# Altium schematic sheet left.SchDoc
size A1
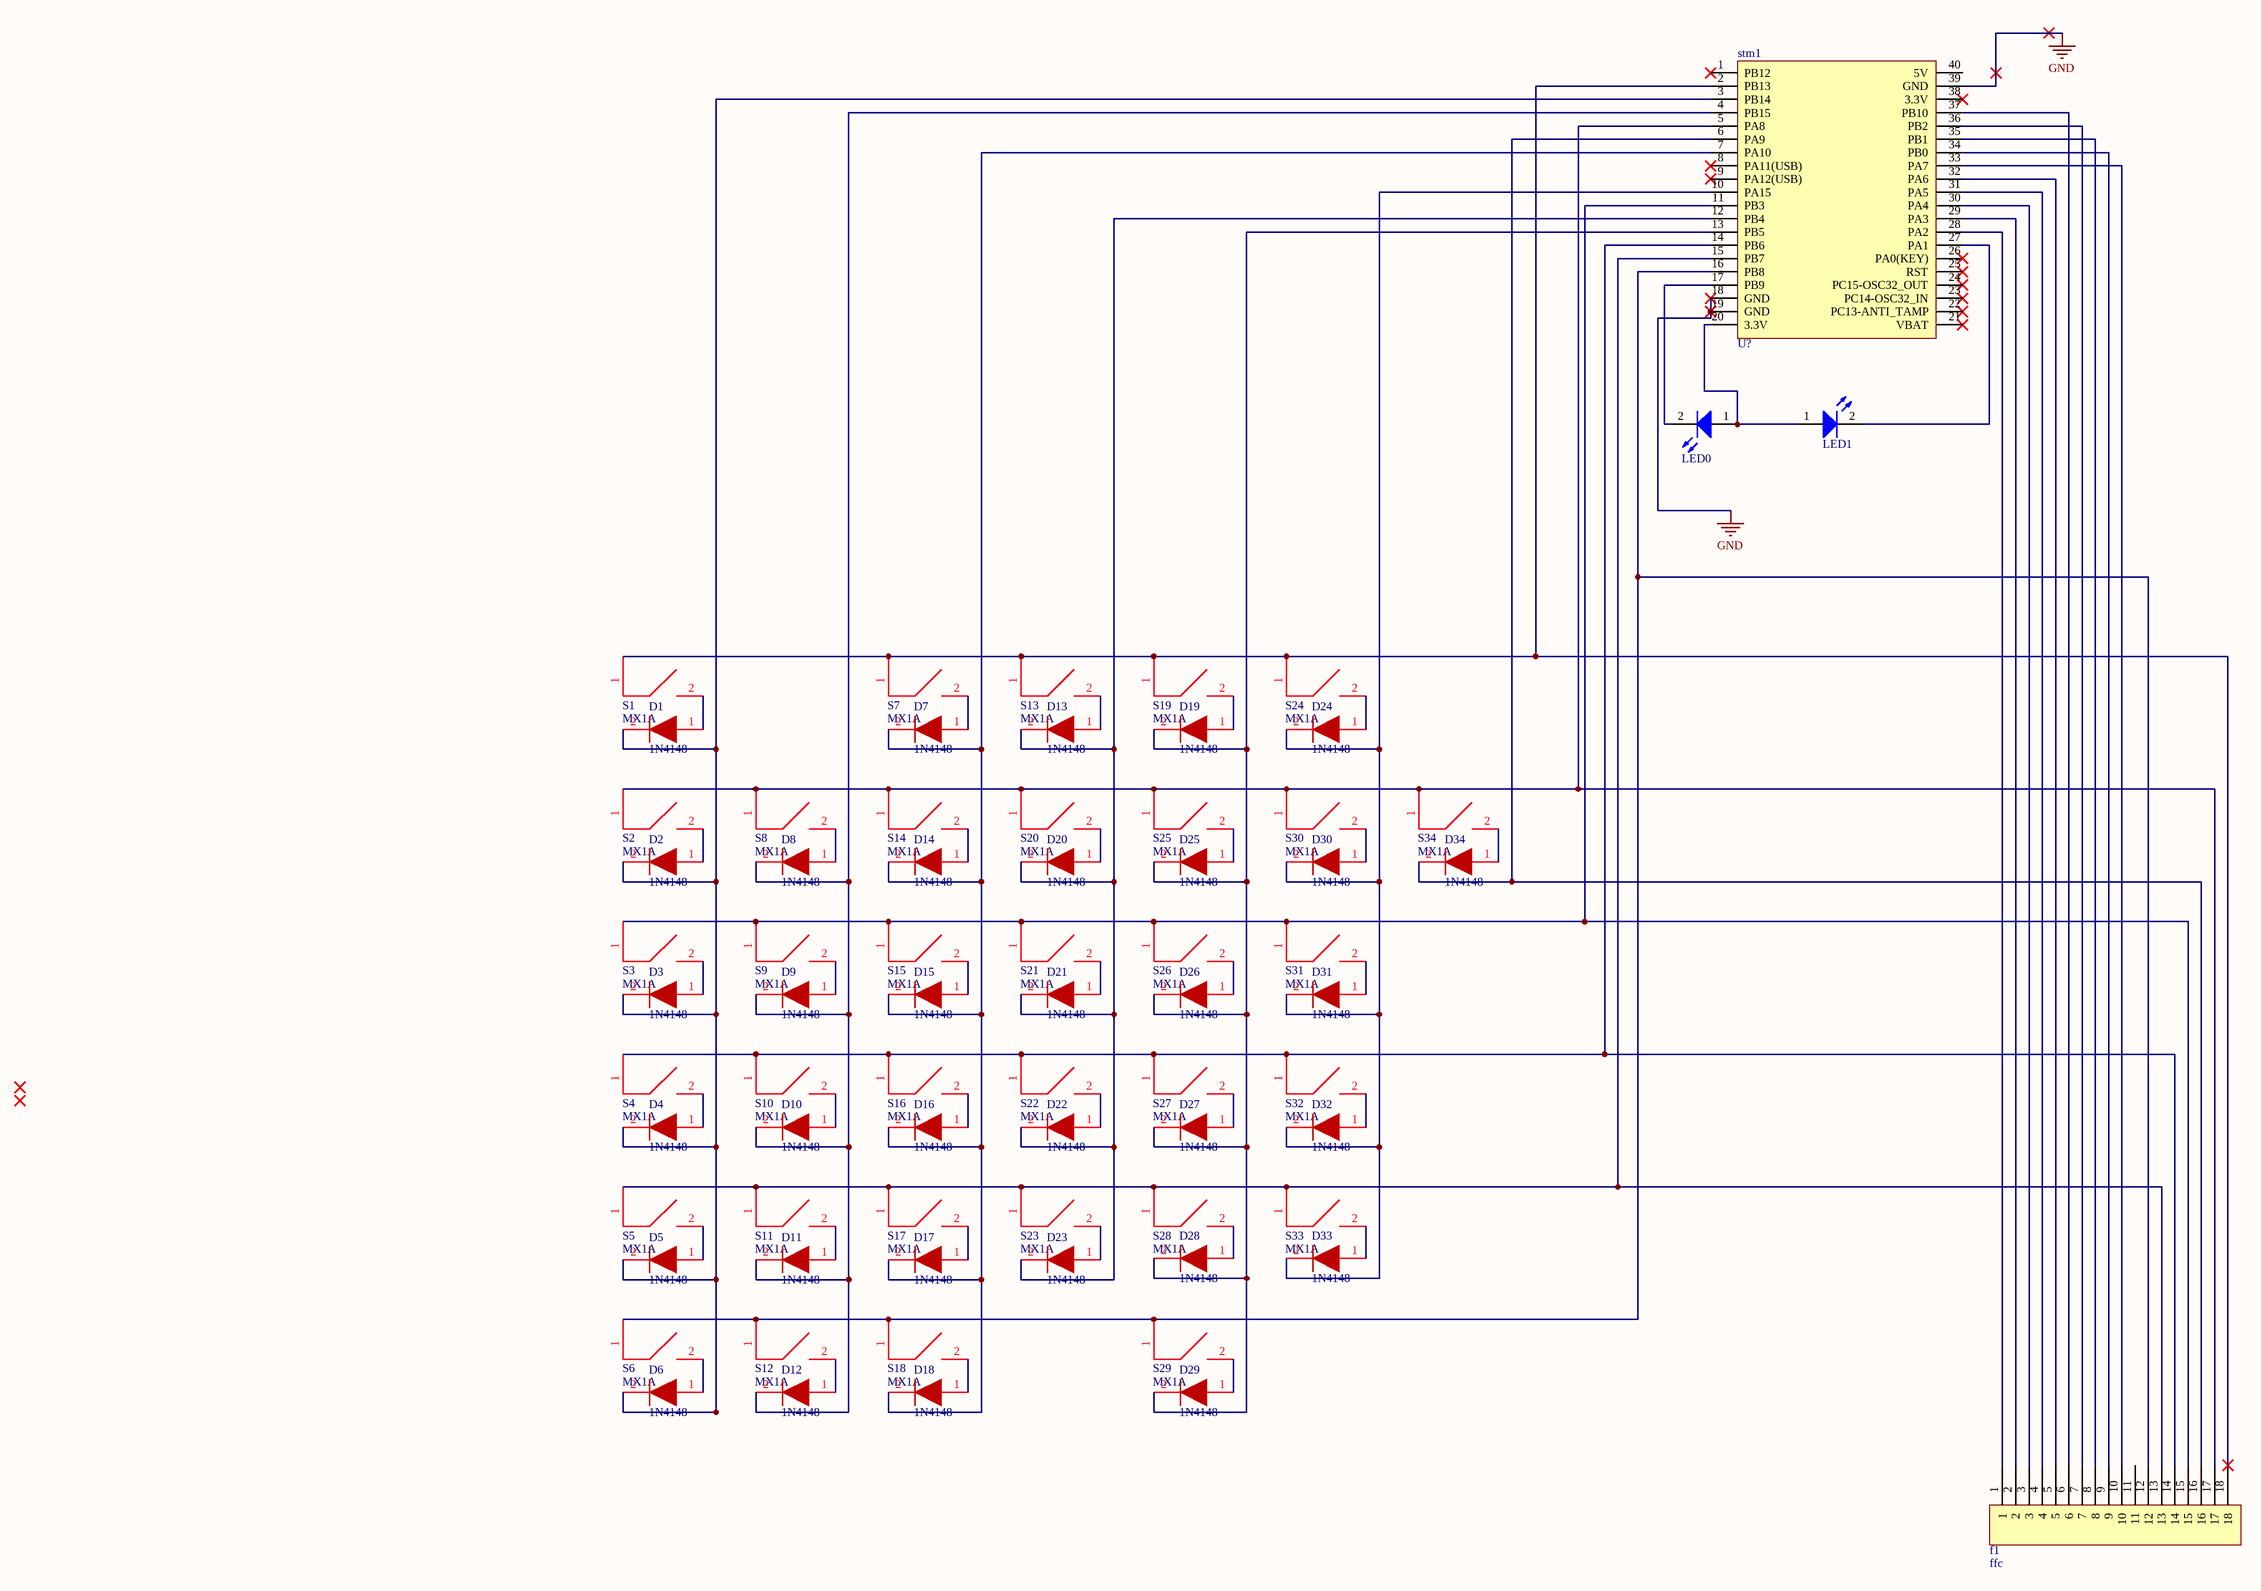
[diagram p0: left.SchDoc]

## Parts
D1  1N4148  [SOD323]
D2  1N4148  [SOD323]
D3  1N4148  [SOD323]
D4  1N4148  [SOD323]
D5  1N4148  [SOD323]
D6  1N4148  [SOD323]
D7  1N4148  [SOD323]
D8  1N4148  [SOD323]
D9  1N4148  [SOD323]
D10  1N4148  [SOD323]
D11  1N4148  [SOD323]
D12  1N4148  [SOD323]
D13  1N4148  [SOD323]
D14  1N4148  [SOD323]
D15  1N4148  [SOD323]
D16  1N4148  [SOD323]
D17  1N4148  [SOD323]
D18  1N4148  [SOD323]
D19  1N4148  [SOD323]
D20  1N4148  [SOD323]
D21  1N4148  [SOD323]
D22  1N4148  [SOD323]
D23  1N4148  [SOD323]
D24  1N4148  [SOD323]
D25  1N4148  [SOD323]
D26  1N4148  [SOD323]
D27  1N4148  [SOD323]
D28  1N4148  [SOD323]
D29  1N4148  [SOD323]
D30  1N4148  [SOD323]
D31  1N4148  [SOD323]
D32  1N4148  [SOD323]
D33  1N4148  [SOD323]
D34  1N4148  [SOD323]
D35  LED0  [LED]
D36  LED1  [LED]
f1  ffc  [FFC]
S1  MX1A  [KEY]
S2  MX1A  [KEY]
S3  MX1A  [KEY]
S4  MX1A  [KEY]
S5  MX1A  [KEY]
S6  MX1A  [KEY]
S7  MX1A  [KEY]
S8  MX1A  [KEY]
S9  MX1A  [KEY]
S10  MX1A  [KEY]
S11  MX1A  [KEY]
S12  MX1A  [KEY]
S13  MX1A  [KEY]
S14  MX1A  [KEY]
S15  MX1A  [KEY]
S16  MX1A  [KEY]
S17  MX1A  [KEY]
S18  MX1A  [KEY]
S19  MX1A  [KEY]
S20  MX1A  [KEY]
S21  MX1A  [KEY]
S22  MX1A  [KEY]
S23  MX1A  [KEY]
S24  MX1A  [KEY]
S25  MX1A  [KEY]
S26  MX1A  [KEY]
S27  MX1A  [KEY]
S28  MX1A  [KEY]
S29  MX1A  [KEY]
S30  MX1A  [KEY]
S31  MX1A  [KEY]
S32  MX1A  [KEY]
S33  MX1A  [KEY]
S34  MX1A  [KEY]
stm1  U?  [stm32f4x1cxu6_core]

## Nets
GND: stm1.18(GND) stm1.19(GND) stm1.39(GND)
NetD1_1: D1.1 S1.2
NetD1_2: D1.2 D2.2 D3.2 D4.2 D5.2 D6.2 stm1.3(PB14)
NetD2_1: D2.1 S2.2
NetD3_1: D3.1 S3.2
NetD4_1: D4.1 S4.2
NetD5_1: D5.1 S5.2
NetD6_1: D6.1 S6.2
NetD7_1: D7.1 S7.2
NetD7_2: D7.2 D14.2 D15.2 D16.2 D17.2 D18.2 stm1.7(PA10)
NetD8_1: D8.1 S8.2
NetD8_2: D8.2 D9.2 D10.2 D11.2 D12.2 stm1.4(PB15)
NetD9_1: D9.1 S9.2
NetD10_1: D10.1 S10.2
NetD11_1: D11.1 S11.2
NetD12_1: D12.1 S12.2
NetD13_1: D13.1 S13.2
NetD13_2: D13.2 D20.2 D21.2 D22.2 D23.2 stm1.12(PB4)
NetD14_1: D14.1 S14.2
NetD15_1: D15.1 S15.2
NetD16_1: D16.1 S16.2
NetD17_1: D17.1 S17.2
NetD18_1: D18.1 S18.2
NetD19_1: D19.1 S19.2
NetD19_2: D19.2 D25.2 D26.2 D27.2 D28.2 D29.2 stm1.13(PB5)
NetD20_1: D20.1 S20.2
NetD21_1: D21.1 S21.2
NetD22_1: D22.1 S22.2
NetD23_1: D23.1 S23.2
NetD24_1: D24.1 S24.2
NetD24_2: D24.2 D30.2 D31.2 D32.2 D33.2 stm1.10(PA15)
NetD25_1: D25.1 S25.2
NetD26_1: D26.1 S26.2
NetD27_1: D27.1 S27.2
NetD28_1: D28.1 S28.2
NetD29_1: D29.1 S29.2
NetD30_1: D30.1 S30.2
NetD31_1: D31.1 S31.2
NetD32_1: D32.1 S32.2
NetD33_1: D33.1 S33.2
NetD34_1: D34.1 S34.2
NetD34_2: D34.2 f1.16 stm1.6(PA9)
NetD35_1: D35.1(A) D36.1(A) stm1.20(3.3V)
NetD35_2: D35.2(K) stm1.17(PB9)
NetD36_2: D36.2(K) stm1.27(PA1)
Netf1_1: f1.1 stm1.28(PA2)
Netf1_2: f1.2 stm1.29(PA3)
Netf1_3: f1.3 stm1.30(PA4)
Netf1_4: f1.4 stm1.31(PA5)
Netf1_5: f1.5 stm1.32(PA6)
Netf1_6: f1.6 stm1.37(PB10)
Netf1_7: f1.7 stm1.36(PB2)
Netf1_8: f1.8 stm1.35(PB1)
Netf1_9: f1.9 stm1.34(PB0)
Netf1_10: f1.10 stm1.33(PA7)
Netf1_12: f1.12 S6.1 S12.1 S18.1 S29.1 stm1.16(PB8)
Netf1_13: f1.13 S5.1 S11.1 S17.1 S23.1 S28.1 S33.1 stm1.15(PB7)
Netf1_14: f1.14 S4.1 S10.1 S16.1 S22.1 S27.1 S32.1 stm1.14(PB6)
Netf1_15: f1.15 S3.1 S9.1 S15.1 S21.1 S26.1 S31.1 stm1.11(PB3)
Netf1_17: f1.17 S2.1 S8.1 S14.1 S20.1 S25.1 S30.1 S34.1 stm1.5(PA8)
Netf1_18: f1.18 S1.1 S7.1 S13.1 S19.1 S24.1 stm1.2(PB13)

Not connected (* = marked no-connect by the designer): f1 11; stm1 1(PB12)* 8(PA11(USB))* 9(PA12(USB))* 21(VBAT)* 22(PC13-ANTI_TAMP)* 23(PC14-OSC32_IN)* 24(PC15-OSC32_OUT)* 25(RST)* 26(PA0(KEY))* 38(3.3V)* 40(5V)

## Library data of the parts
D1-D34 = 1N4148: 二极管
D35 D36 = LED0: Typical INFRARED GaAs LED; Published: 8-Jun-2000; LatestRevisionDate: 08-Jul-2005; LatestRevisionNote: Mech Layer 1 removed.; PackageReference: LED-0; Publisher: Altium Limited; PackageDescription: LED; 2 Leads
S1-S34 = MX1A: 按键
stm1 = stm32f4x1cxu6_core